# EAGLE schematic Keg Cop - Main (EAGLE 9.6.2)
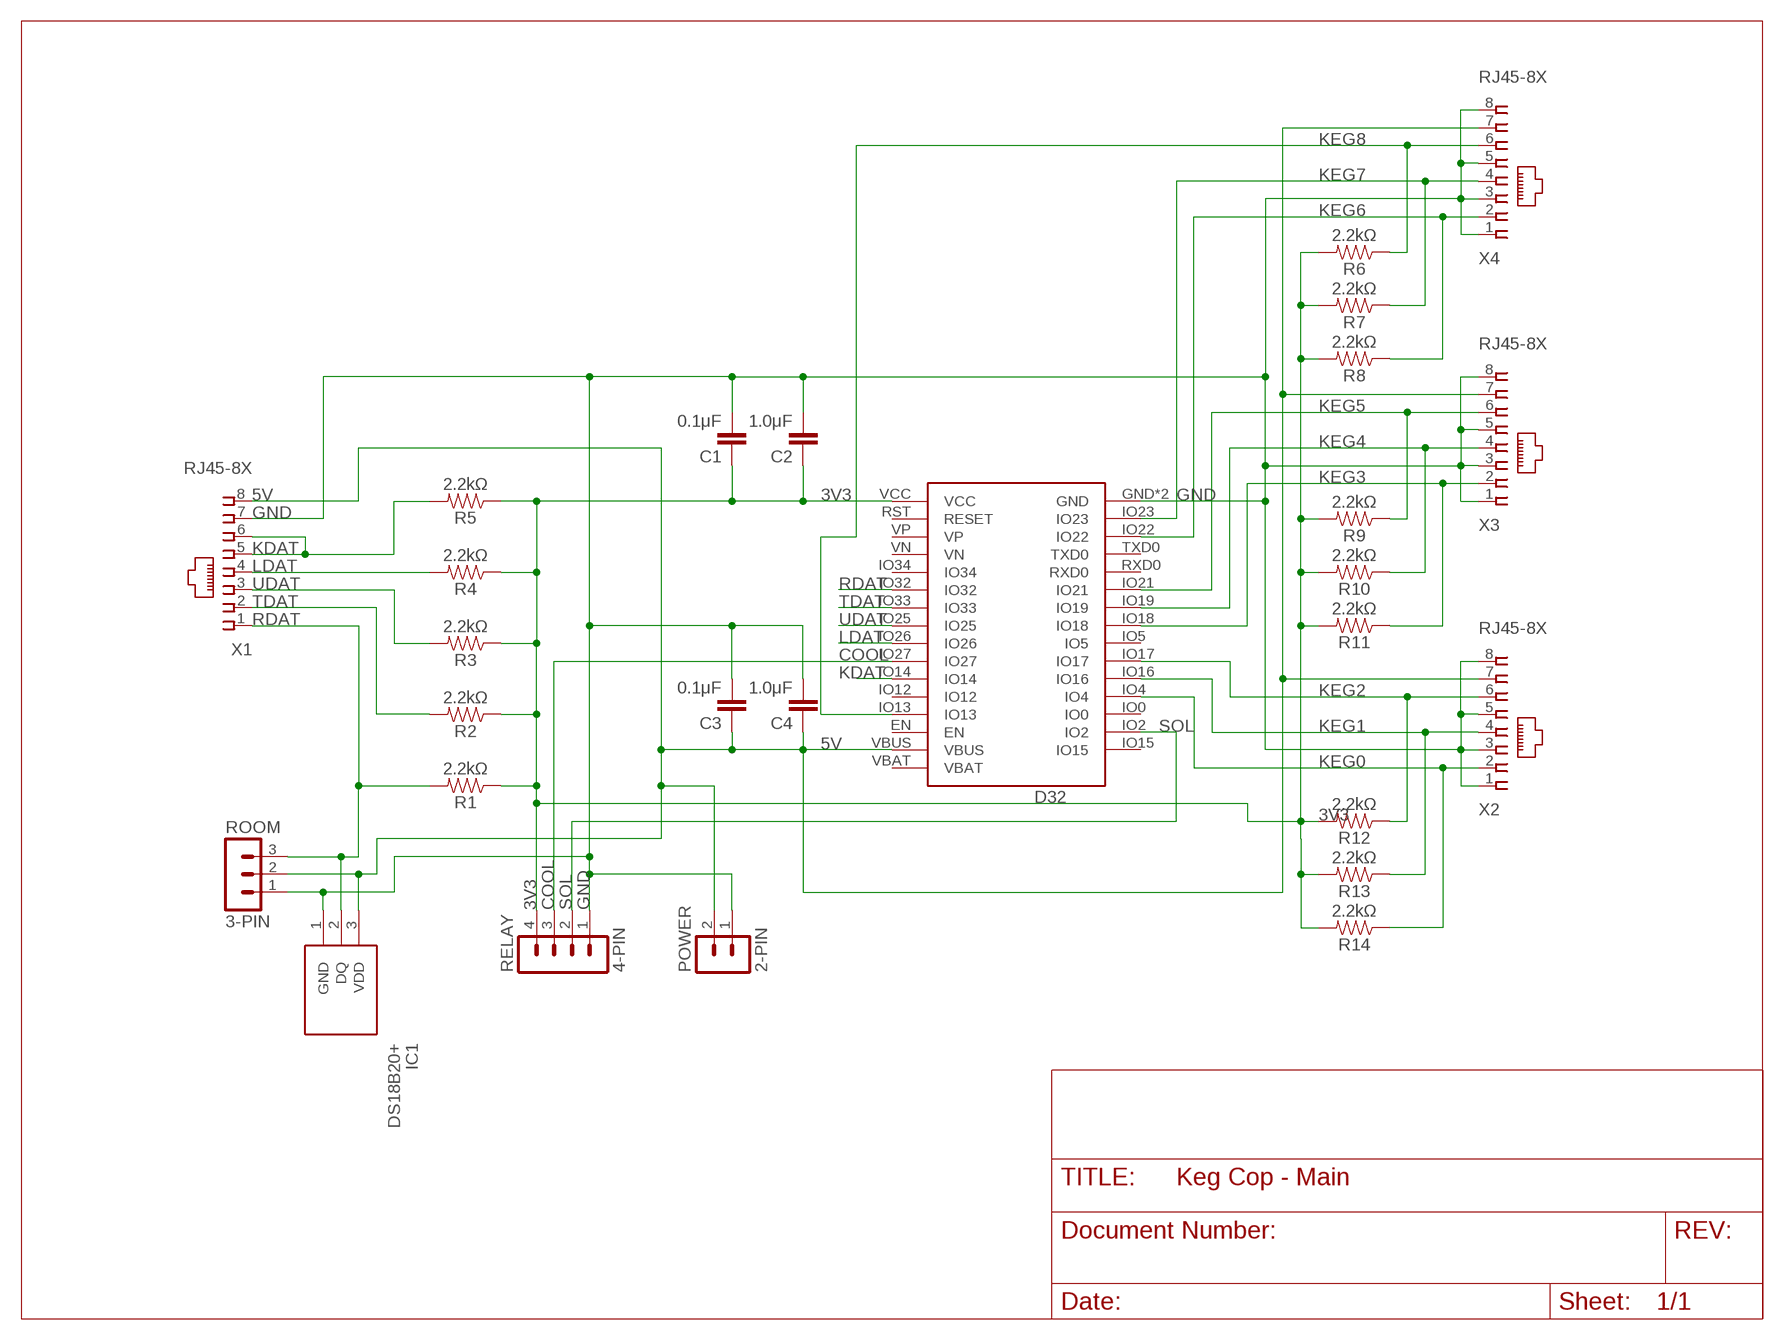
[diagram p0: schematic, sheet 1]

## Parts
C1  0.1μF  CAP_CERAMIC_2.54  [CAP_PTH-2.54]
C2  1.0μF  CAP_CERAMIC_2.54  [CAP_PTH-2.54]
C3  0.1μF  CAP_CERAMIC_2.54  [CAP_PTH-2.54]
C4  1.0μF  CAP_CERAMIC_2.54  [CAP_PTH-2.54]
D32  Lolin D32  WEMOS-D32D32_NO_BATT  [D32_NO_BATT]
IC1  DS18B20+  [TO-92]
POWER  2-PIN  HDR-2  [HDR-2_VERT]
R1  2.2kΩ  RESISTORAXIAL-0.3  [AXIAL-0.3]
R2  2.2kΩ  RESISTORAXIAL-0.3  [AXIAL-0.3]
R3  2.2kΩ  RESISTORAXIAL-0.3  [AXIAL-0.3]
R4  2.2kΩ  RESISTORAXIAL-0.3  [AXIAL-0.3]
R5  2.2kΩ  RESISTORAXIAL-0.3  [AXIAL-0.3]
R6  2.2kΩ  RESISTORAXIAL-0.3  [AXIAL-0.3]
R7  2.2kΩ  RESISTORAXIAL-0.3  [AXIAL-0.3]
R8  2.2kΩ  RESISTORAXIAL-0.3  [AXIAL-0.3]
R9  2.2kΩ  RESISTORAXIAL-0.3  [AXIAL-0.3]
R10  2.2kΩ  RESISTORAXIAL-0.3  [AXIAL-0.3]
R11  2.2kΩ  RESISTORAXIAL-0.3  [AXIAL-0.3]
R12  2.2kΩ  RESISTORAXIAL-0.3  [AXIAL-0.3]
R13  2.2kΩ  RESISTORAXIAL-0.3  [AXIAL-0.3]
R14  2.2kΩ  RESISTORAXIAL-0.3  [AXIAL-0.3]
RELAY  4-PIN  MA04-1  [MA04-1]
ROOM  3-PIN  HDR-3  [HDR-3_VERT]
X1  RJ45-8X  [RJ45-NO-SHIELD]
X2  RJ45-8X  [RJ45-NO-SHIELD]
X3  RJ45-8X  [RJ45-NO-SHIELD]
X4  RJ45-8X  [RJ45-NO-SHIELD]

## Nets
3V3 [3v]: C1.1 C2.1 D32.VCC R1.P$1 R2.P$1 R3.P$1 R4.P$1 R5.P$1 R6.P$2 R7.P$2 R8.P$2 R9.P$2 R10.P$2 R11.P$2 R12.P$2 R13.P$2 R14.P$2 RELAY.4
5V [5v]: C3.1 C4.1 D32.VBUS IC1.3(VDD) POWER.2 ROOM.2 X1.8 X2.7 X3.7 X4.7
COOL: D32.IO27 RELAY.3
GND: C1.2 C2.2 C3.2 C4.2 D32.GND D32.GND2(GND) IC1.1(GND) POWER.1 RELAY.1 ROOM.1 X1.7 X2.1 X2.3 X2.5 X2.8 X3.1 X3.3 X3.5 X3.8 X4.1 X4.3 X4.5 X4.8
KDAT: D32.IO14 R5.P$2 X1.5 X1.6
KEG0: D32.IO4 R14.P$1 X2.2
KEG1: D32.IO16 R13.P$1 X2.4
KEG2: D32.IO17 R12.P$1 X2.6
KEG3: D32.IO18 R11.P$1 X3.2
KEG4: D32.IO19 R10.P$1 X3.4
KEG5: D32.IO21 R9.P$1 X3.6
KEG6: D32.IO22 R8.P$1 X4.2
KEG7: D32.IO23 R7.P$1 X4.4
KEG8: D32.IO13 R6.P$1 X4.6
LDAT: D32.IO26 R4.P$2 X1.4
RDAT: D32.IO32 IC1.2(DQ) R1.P$2 ROOM.3 X1.1
SOL: D32.IO2 RELAY.2
TDAT: D32.IO33 R2.P$2 X1.2
UDAT: D32.IO25 R3.P$2 X1.3
Unconnected: D32.EN D32.IO0 D32.IO5 D32.IO12 D32.IO15 D32.IO34 D32.RST(RESET) D32.RXD0 D32.TXD0 D32.VBAT D32.VN D32.VP

## Library data of the parts
C1-C4 = Donnie:CAP_CERAMIC_2.54
D32 = Donnie:WEMOS-D32: D32_REVERSE is a Reverse silkscreen for placing the Wemos D32 on the underside of the board D32_NO-KEEPOUT removes the keepout area beneath the antenna on the D32 and provides a note to avoid components and traces.
IC1 = SamacSys_Parts:DS18B20+: DS18B20 prog thermometer 1-Wire, TO92 Source: Datasheet <http://docs-emea.rs-online.com/webdocs/078b/0900766b8078b130.pdf>; ARROW_PART_NUMBER: DS18B20+; DESCRIPTION: DS18B20 prog thermometer 1-Wire, TO92; HEIGHT: mm; MANUFACTURER_NAME: Maxim Integrated; MANUFACTURER_PART_NUMBER: DS18B20+; MOUSER_PART_NUMBER: 700-DS18B20+; MOUSER_PRICE-STOCK: https://www.mouser.co.uk/ProductDetail/Maxim-Integrated/DS18B20%2b?qs=7H2Jq%252ByxpJKegCKabDbglA%3D%3D
POWER = Donnie:HDR-2
R1-R14 = SparkFun-Resistors:RESISTOR: Generic Resistor Package
RELAY = Donnie:MA04-1: PIN HEADER; OC_FARNELL: unknown; OC_NEWARK: unknown
ROOM = Donnie:HDR-3: PIN HEADER
X1-X4 = con-tycoelectronics:RJ45: CORCOM Modular RJ Jacks No Shield Source: www.tycoelectronics.com .. ENG_DS_1654001_1099_RJ_L_0507.pdf; MPN: RJ45-8X; OC_FARNELL: unknown; OC_NEWARK: 16R6101

## Net classes
0 default: width 0.305 mm, clearance 0.305 mm
1 5v: width 0.406 mm, clearance 0.406 mm
2 3v: width 0.406 mm, clearance 0.406 mm